# Altium schematic sheet POWER.SchDoc (part 2 of 2)
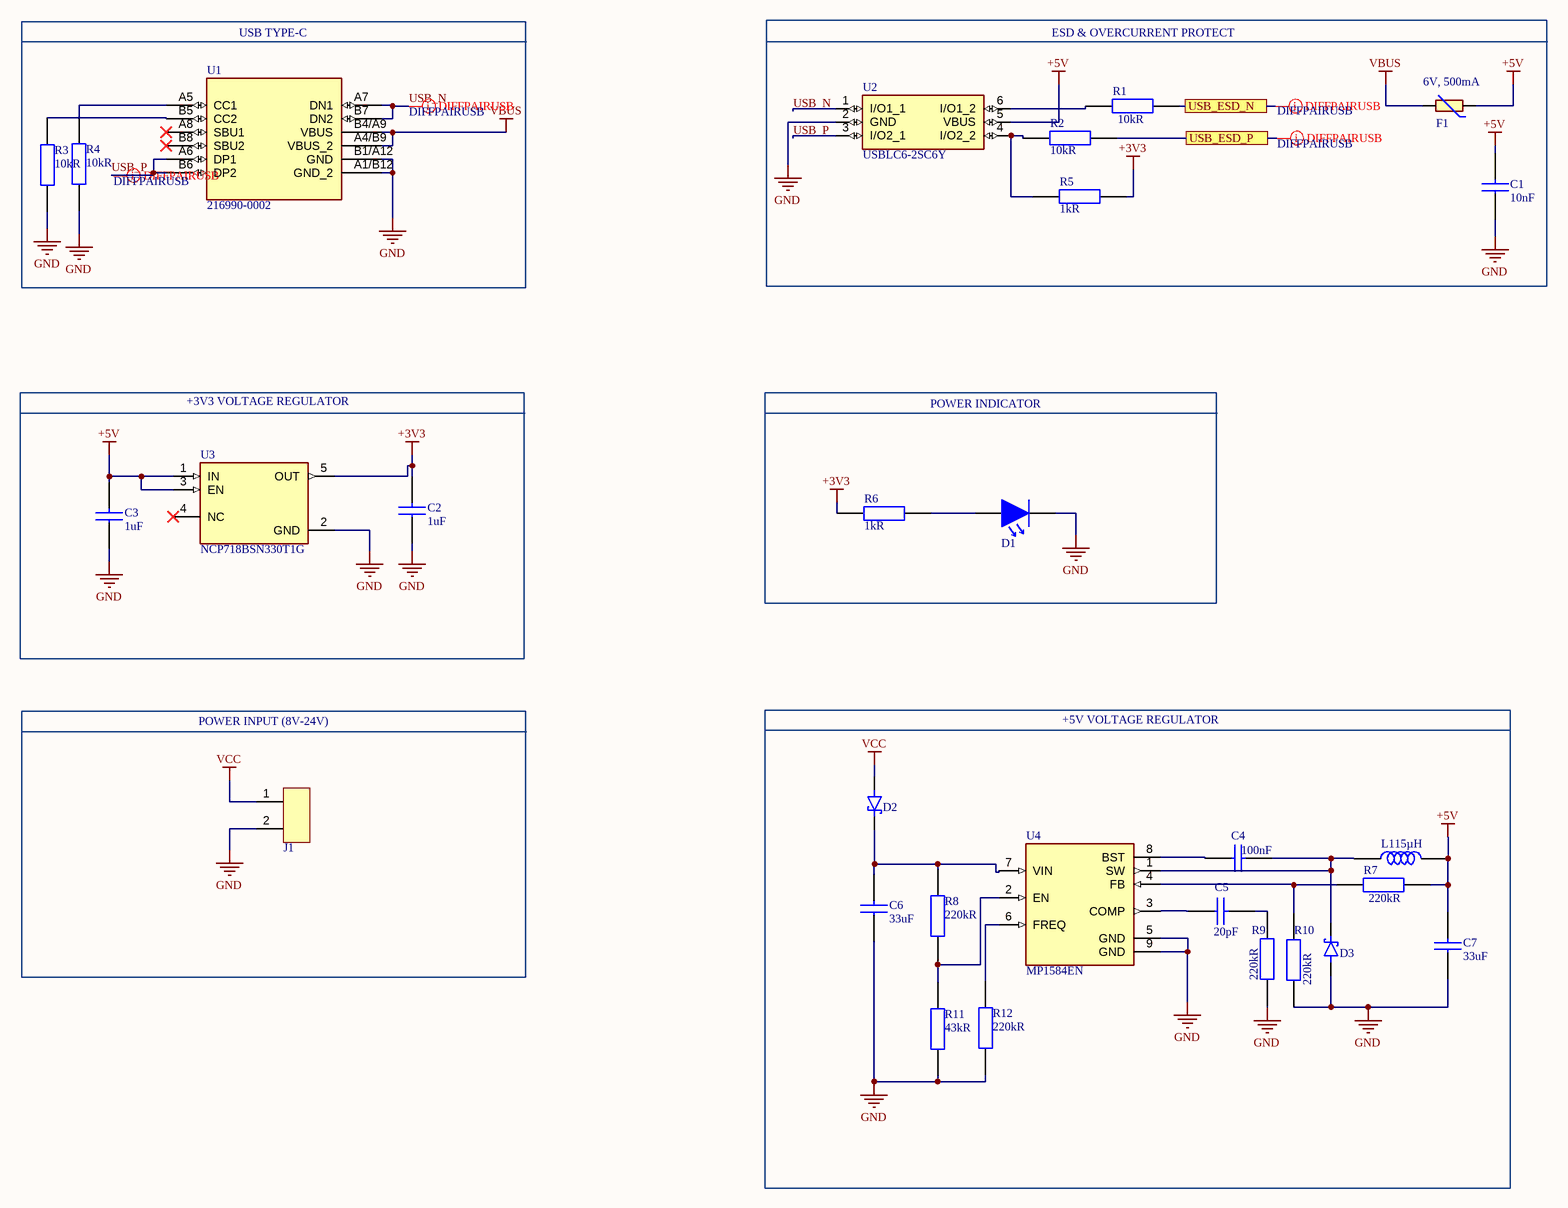
[diagram p1: POWER.SchDoc]

## Library data of the parts
C1 = CAP CER 10nF 0603: CAP CER 10nF %10 0603; Manufacturer: Walsin Technologies; Designed by: BERK; Tolerance: 10%; Dielectric: X7R; Voltage Rating: 16V; Supplier 1: Digi-Key; Manufacturer Part Number: 0603B103K160CT; RoHS: Yes; Category: Ceramic Capacitors; Stock 1: 102474; Pricing 1: 1=0,10000, 10=0,03600, 50=0,01940, 100=0,01590, 500=0,01136, 1000=0,00892 (USD); Case/Package: 0603; Case Code (Metric): 1608; Case Code (Imperial): 0603; Min Operating Temperature: -55°C; Max Operating Temperature: 125°C; Packaging: Tape and Reel; Voltage Rating (DC): 16V; Length: 1.6mm; Depth: 0.8mm; REACH SVHC: Unknown; RoHS Compliant: Yes; ComponentLink1URL: http://www.farnell.com/datasheets/1958513.pdf?src-supplier=Farnell; ComponentLink1Description: http://www.farnell.com/datasheets/1958513.pdf?src-supplier=Farnell; ComponentLink2URL: http://components.arrow.com/part/dataview/0323_00656382?src-supplier=Arrow+Europe; ComponentLink2Description: http://components.arrow.com/part/dataview/0323_00656382?src-supplier=Arrow+Europe; ComponentLink3URL: http://www.farnell.com/datasheets/1958513.pdf?src-supplier=Element14; ComponentLink3Description: http://www.farnell.com/datasheets/1958513.pdf?src-supplier=Element14; ComponentLink4URL: http://www.passivecomponent.com/wp-content/uploads/2018/10/MLCC.pdf?src-supplier=Digi-Key; ComponentLink4Description: http://www.passivecomponent.com/wp-content/uploads/2018/10/MLCC.pdf?src-supplier=Digi-Key; Supplier Part Number 1: 1292-1384-1-ND
C2 C3 = CAP CER 1uF 0805: CAP CER 1uF %10 0805; Manufacturer: Samsung; Designed by: BERK; Tolerance: 10%; Voltage Rating: 50V; Dielectric: X7R; Supplier 1: Digi-Key; Manufacturer Part Number: CL21B105KBFNNNE; RoHS: Yes; Category: Ceramic Capacitors; Stock 1: 958000; Pricing 1: 2000=0,02138, 4000=0,01956 (USD); Mount: Surface Mount; Case/Package: 0805; Case Code (Metric): 2012; Case Code (Imperial): 0805; Min Operating Temperature: -55°C; Max Operating Temperature: 125°C; Packaging: Tape and Reel; Package Quantity: 1; Voltage: 50V; Series: CL; Construction: Flat; Length: 2mm; Width: 0.049inch; Height: 1.25mm; Thickness: 0.053inch; Depth: 1.25mm; Radiation Hardening: No; RoHS Compliant: Yes; ComponentLink1URL: https://datasheet.ciiva.com/25800/cl21b105kbfnnne-25800291.pdf?src-supplier=Digi-Key; ComponentLink1Description: https://datasheet.ciiva.com/25800/cl21b105kbfnnne-25800291.pdf?src-supplier=Digi-Key; ComponentLink2URL: https://datasheet.ciiva.com/16449/cl21b105kbfnnne-16449003.pdf?src-supplier=Future+Electronics; ComponentLink2Description: https://datasheet.ciiva.com/16449/cl21b105kbfnnne-16449003.pdf?src-supplier=Future+Electronics; ComponentLink3URL: https://datasheet.ciiva.com/26838/getdatasheetpartid-354075-26838668.pdf?src-supplier=Verical; ComponentLink3Description: https://datasheet.ciiva.com/26838/getdatasheetpartid-354075-26838668.pdf?src-supplier=Verical; Supplier Part Number 1: 1276-1029-2-ND
C4 = CAP CER 100nF 0603: CAP CER 100nF %10 0603 SMD; Manufacturer: KEMET; Designed by: BERK; Dielectric Material: Ceramic; Voltage Rating (DC): 50V; Tolerance: 10%; Dielectric: X7R; Dissipation Factor: 2.5%; Supplier 1: Digi-Key; Manufacturer Part Number: C0603C104K5RACTU; RoHS: Yes; Category: Ceramic Capacitors; Stock 1: 1666186; Pricing 1: 1=0,12000, 10=0,08500, 50=0,04620, 100=0,03770, 500=0,02696, 1000=0,02118 (USD); Mount: Surface Mount; Case/Package: 0603; Number of Pins: 2; Case Code (Metric): 1608; Case Code (Imperial): 0603; Contact Plating: Tin,Matte; Min Operating Temperature: -55°C; Max Operating Temperature: 125°C; Packaging: Tape and Reel; Package Quantity: 1; Termination: SMD/SMT; Voltage: 50V; Voltage Rating: 50V; Series: SMD Comm X7R; Length: 0.063inch; Width: 0.031inch; Height: 0.8mm; Thickness: 0.034inch; Lead Pitch: 0.7mm; Depth: 0.8mm; Radiation Hardening: No; RoHS Compliant: Yes; REACH SVHC: No SVHC; ComponentLink1URL: https://datasheet.ciiva.com/7823/kem-c1002-x7r-smd-7823591.pdf?src-supplier=Element14; ComponentLink1Description: https://datasheet.ciiva.com/7823/kem-c1002-x7r-smd-7823591.pdf?src-supplier=Element14; ComponentLink2URL: https://datasheet.ciiva.com/14602/70095383-14602583.pdf?src-supplier=Allied+Electronics; ComponentLink2Description: https://datasheet.ciiva.com/14602/70095383-14602583.pdf?src-supplier=Allied+Electronics; ComponentLink3URL: https://datasheet.ciiva.com/5999/kem-c1002-x7r-smd-5999400.pdf?src-supplier=Farnell; ComponentLink3Description: https://datasheet.ciiva.com/5999/kem-c1002-x7r-smd-5999400.pdf?src-supplier=Farnell; ComponentLink4URL: https://datasheet.ciiva.com/7823/kem-c1002-x7r-smd-7823592.pdf?src-supplier=Element14; ComponentLink4Description: https://datasheet.ciiva.com/7823/kem-c1002-x7r-smd-7823592.pdf?src-supplier=Element14; ComponentLink5URL: https://datasheet.ciiva.com/28645/1851736-28645640.pdf?src-supplier=Element14; ComponentLink5Description: https://datasheet.ciiva.com/28645/1851736-28645640.pdf?src-supplier=Element14; ComponentLink6URL: https://datasheet.ciiva.com/14585/70095383-14585209.pdf?src-supplier=Allied+Electronics; ComponentLink6Description: https://datasheet.ciiva.com/14585/70095383-14585209.pdf?src-supplier=Allied+Electronics; Supplier Part Number 1: 399-5089-1-ND
C5 = CAP CER 20pF 0603: CAP CER 20pF %5 0603 SMD; Manufacturer: Samsung; Tolerance: 5%; Dielectric: C0G; Voltage Rating: 50V; Temperature Coefficient: 300ppm/°C; Designed by: BERK; Supplier 1: Digi-Key; Manufacturer Part Number: CL10C200JB8NNNC; RoHS: Yes; Category: Ceramic Capacitors; Stock 1: 765558; Pricing 1: 1=0,10000, 10=0,04700, 50=0,02560, 100=0,02090, 500=0,01490, 1000=0,01171 (USD); Mount: Surface Mount; Case/Package: 0603; Case Code (Metric): 1608; Case Code (Imperial): 0603; Min Operating Temperature: -55°C; Max Operating Temperature: 125°C; Package Quantity: 1; Packaging: Tape and Reel; Voltage: 50V; Series: CL; Construction: Flat; Length: 1.6mm; Width: 0.031inch; Height: 0.8mm; Thickness: 0.035inch; Depth: 0.8mm; Radiation Hardening: No; RoHS Compliant: Yes; ComponentLink1URL: https://datasheet.ciiva.com/26877/getdatasheetpartid-640634-26877974.pdf?src-supplier=Verical; ComponentLink1Description: https://datasheet.ciiva.com/26877/getdatasheetpartid-640634-26877974.pdf?src-supplier=Verical; ComponentLink2URL: https://datasheet.ciiva.com/26310/mlcc-catalogdownload2013-eng-26310315.pdf?src-supplier=Distrelec; ComponentLink2Description: https://datasheet.ciiva.com/26310/mlcc-catalogdownload2013-eng-26310315.pdf?src-supplier=Distrelec; Supplier Part Number 1: 1276-1187-1-ND
C6 C7 = CAP CER 33uF 1206: CAP CER 33uF %20 1206 SMD; Manufacturer: TDK; Dielectric Material: Ceramic; Voltage Rating: 25V; Tolerance: 20%; Dielectric: X5R; Designed by: BERK; Supplier 1: Digi-Key; Manufacturer Part Number: C3216X5R1E336M160AC; RoHS: Yes; Category: Ceramic Capacitors; Stock 1: 149381; Pricing 1: 1=1,04000, 10=0,82500, 50=0,71500, 100=0,61880, 500=0,46750, 1000=0,41250 (USD); Mount: Surface Mount; Case/Package: 1206; Case Code (Metric): 3216; Case Code (Imperial): 1206; Weight: 0.000571oz; Min Operating Temperature: -55°C; Max Operating Temperature: 85°C; Packaging: Tape and Reel; Termination: SMD/SMT; Package Quantity: 1; Voltage Rating (DC): 25V; Resistor Type: Ceramic; Series: C; Length: 3.2mm; Width: 0.063inch; Depth: 1.6mm; Thickness: 1.6mm; REACH SVHC: No SVHC; Lead Free: Lead Free; RoHS Compliant: Yes; ComponentLink1URL: https://datasheet.ciiva.com/24216/c3216x5r1e336m160ac-265051-24216512.pdf?src-supplier=Mouser; ComponentLink1Description: https://datasheet.ciiva.com/24216/c3216x5r1e336m160ac-265051-24216512.pdf?src-supplier=Mouser; ComponentLink2URL: https://datasheet.ciiva.com/6285/tdkmlcccaprange-6285278.pdf?src-supplier=Digi-Key; ComponentLink2Description: https://datasheet.ciiva.com/6285/tdkmlcccaprange-6285278.pdf?src-supplier=Digi-Key; Supplier Part Number 1: 445-8046-1-ND
D1 = LED RED 0805: LED Uni-Color Hyper Red 660nm 2-Pin Chip 0805(2012Metric) T/R; Manufacturer: Osram Opto; Lens Color: White; Forward Voltage: 1.8V; Lens Style: Diffused,Flat,Colorless; Luminous Intensity: 71mcd; Viewing Angle: 160°; Forward Current: 30mA; Dominant Wavelength: 645nm; Number of Elements: 1; Test Current: 20mA; Reverse Voltage: 5V; Lens Transparency: Diffused; Luminous Flux: 0.17lm; Lens Size: 1.25mm; Designed by: BERK; Supplier 1: Digi-Key; Manufacturer Part Number: LH R974-LP-1; RoHS: Yes; Category: LEDs; Stock 1: 35632; Pricing 1: 1=0,26000, 10=0,13900, 100=0,06480, 500=0,05978, 1000=0,04683, 2000=0,04584 (USD); Mount: Surface Mount; Case/Package: 0805; Number of Pins: 2; Color: Red; Case Code (Imperial): 0805; Case Code (Metric): 2012; Min Operating Temperature: -30°C; Max Operating Temperature: 85°C; Packaging: Tape and Reel; Illumination Color: Red; Package Quantity: 1; Series: CHipLED; Length: 2.1mm; Width: 1.25mm; Depth: 1.35mm; Radiation Hardening: No; RoHS Compliant: Yes; ComponentLink1URL: http://www.jameco.com/Jameco/Products/ProdDS/2085634.pdf?src-supplier=Jameco; ComponentLink1Description: http://www.jameco.com/Jameco/Products/ProdDS/2085634.pdf?src-supplier=Jameco; ComponentLink2URL: http://components.arrow.com/part/dataview/0323_01825492?src-supplier=Arrow+Europe; ComponentLink2Description: http://components.arrow.com/part/dataview/0323_01825492?src-supplier=Arrow+Europe; ComponentLink3URL: https://dammedia.osram.info/media/resource/hires/osram-dam-2493888/LH%20R974.pdf?src-supplier=Digi-Key; ComponentLink3Description: https://dammedia.osram.info/media/resource/hires/osram-dam-2493888/LH%20R974.pdf?src-supplier=Digi-Key; ComponentLink4URL: http://www.mouser.com/ds/2/311/LH%20R974%20-%20CHIPLED%200805-318659.pdf?src-supplier=Mouser; ComponentLink4Description: http://www.mouser.com/ds/2/311/LH%20R974%20-%20CHIPLED%200805-318659.pdf?src-supplier=Mouser; ComponentLink5URL: https://www.verical.com/server-webapp/html/getDatasheet?partID=258950&src-supplier=Verical; ComponentLink5Description: https://www.verical.com/server-webapp/html/getDatasheet?partID=258950&src-supplier=Verical; ComponentLink6URL: http://components.arrow.com/part/dataview/41971690S1077610N9133?src-supplier=Arrow+Electronics; ComponentLink6Description: http://components.arrow.com/part/dataview/41971690S1077610N9133?src-supplier=Arrow+Electronics; ComponentLink7URL: http://components.arrow.com/part/dataview/41971690S6190115N2128?src-supplier=Arrow+Electronics; ComponentLink7Description: http://components.arrow.com/part/dataview/41971690S6190115N2128?src-supplier=Arrow+Electronics; Supplier Part Number 1: 475-1415-1-ND
D2 = MBRS320: Schottky Power Rectifier, Surface Mount, Fast Soft-Recovery, 3.0 A, 200 V; Manufacturer: onsemi; Manufacturer Part Number: MBRS3201T3G; Manufacturer Lifecycle Status: ACTIVE; Average Rectified Current: 3A; Element Configuration: Single; Forward Voltage: 590mV; Max Forward Surge Current (Ifsm): 100A; Max Repetitive Reverse Voltage (Vrrm): 200V; Max Reverse Leakage Current: 5µA; Number of Elements: 1; Polarity: Standard; Recovery Time: 35ns; Supplier 1: Future Electronics; RoHS: Compliant; Category: Schottky Diodes; Stock 1: 85000; Pricing 1: 2500=0,255, 5000=0,25 (USD); Case/Package: SMC; China RoHS: Non-Compliant; Contact Plating: Tin; Current Rating: 3A; Forward Current: 3A; Halogen Free: Halogen Free; Height: 2.26mm; Lead Free: Lead Free; Length: 7.11mm; Lifecycle Status: Production; Max Operating Temperature: 150°C; Max Output Current: 3A; Max Reverse Voltage (DC): 200V; Max Surge Current: 100A; Min Operating Temperature: -55°C; Number of Pins: 2; Number of Terminals: 2; Output Current: 3A; Packaging: Tape and Reel; Peak Non-Repetitive Surge Current: 100A; Peak Reverse Current: 5µA; Radiation Hardening: No; REACH SVHC: No; Reverse Recovery Time: 35ns; Reverse Standoff Voltage: 200V; Schedule B: 8541100080; Voltage Rating (DC): 200V; Width: 6.1mm; ComponentLink1URL: https://datasheet.octopart.com:443/MBRS3201T3G-onsemi-datasheet-180961793.pdf?src-supplier=IHS; ComponentLink1Description: https://datasheet.octopart.com:443/MBRS3201T3G-onsemi-datasheet-180961793.pdf?src-supplier=IHS; ComponentLink2URL: https://datasheet.octopart.com:443/MBRS3201T3G-ON-Semiconductor-datasheet-139011814.pdf?src-supplier=Upverter; ComponentLink2Description: https://datasheet.octopart.com:443/MBRS3201T3G-ON-Semiconductor-datasheet-139011814.pdf?src-supplier=Upverter; ComponentLink3URL: https://datasheet.octopart.com:443/MBRS3201T3G-ON-Semiconductor-datasheet-12543837.pdf?src-supplier=element14+APAC; ComponentLink3Description: https://datasheet.octopart.com:443/MBRS3201T3G-ON-Semiconductor-datasheet-12543837.pdf?src-supplier=element14+APAC; ComponentLink4URL: https://datasheet.octopart.com:443/MBRS3201T3G.-ON-Semiconductor-datasheet-93401475.pdf?src-supplier=element14+APAC; ComponentLink4Description: https://datasheet.octopart.com:443/MBRS3201T3G.-ON-Semiconductor-datasheet-93401475.pdf?src-supplier=element14+APAC; ComponentLink5URL: https://datasheet.octopart.com:443/MBRS3201T3G-onsemi-datasheet-181959052.pdf?src-supplier=Farnell; ComponentLink5Description: https://datasheet.octopart.com:443/MBRS3201T3G-onsemi-datasheet-181959052.pdf?src-supplier=Farnell; ComponentLink6URL: https://datasheet.octopart.com:443/MBRS3201T3G-ON-Semiconductor-datasheet-8629983.pdf?src-supplier=Factory+Futures; ComponentLink6Description: https://datasheet.octopart.com:443/MBRS3201T3G-ON-Semiconductor-datasheet-8629983.pdf?src-supplier=Factory+Futures; ComponentLink7URL: https://datasheet.octopart.com:443/MBRS3201T3G-onsemi-datasheet-178031918.pdf?src-supplier=Burklin+Elektronik; ComponentLink7Description: https://datasheet.octopart.com:443/MBRS3201T3G-onsemi-datasheet-178031918.pdf?src-supplier=Burklin+Elektronik; ComponentLink8URL: https://datasheet.octopart.com:443/MBRS3201T3G-ON-Semiconductor-datasheet-14055231.pdf?src-supplier=iiiC; ComponentLink8Description: https://datasheet.octopart.com:443/MBRS3201T3G-ON-Semiconductor-datasheet-14055231.pdf?src-supplier=iiiC; ComponentLink9URL: http://sigma.octopart.com:80/15540786/rohs_certificate/ON-Semiconductor-MBRS3201T3G.pdf?src-supplier=Compliance+Statements; ComponentLink9Description: http://sigma.octopart.com:80/15540786/rohs_certificate/ON-Semiconductor-MBRS3201T3G.pdf?src-supplier=Compliance+Statements; ComponentLink10URL: http://sigma.octopart.com:80/15677732/materials_sheet/ON-Semiconductor-MBRS3201T3G.csv?src-supplier=Compliance+Statements; ComponentLink10Description: http://sigma.octopart.com:80/15677732/materials_sheet/ON-Semiconductor-MBRS3201T3G.csv?src-supplier=Compliance+Statements; ComponentLink11URL: http://sigma.octopart.com:80/150614326/rohs_statement/ON-Semiconductor-MBRS3201T3G.pdf?src-supplier=Compliance+Statements; ComponentLink11Description: http://sigma.octopart.com:80/150614326/rohs_statement/ON-Semiconductor-MBRS3201T3G.pdf?src-supplier=Compliance+Statements; ComponentLink12URL: http://sigma.octopart.com:80/reach_statement/ON-Semiconductor-company-79.pdf?src-supplier=Compliance+Statements; ComponentLink12Description: http://sigma.octopart.com:80/reach_statement/ON-Semiconductor-company-79.pdf?src-supplier=Compliance+Statements; ComponentLink13URL: http://sigma.octopart.com:80/rohs_statement/Fairchild-Semiconductor-company-11.pdf?src-supplier=Compliance+Statements; ComponentLink13Description: http://sigma.octopart.com:80/rohs_statement/Fairchild-Semiconductor-company-11.pdf?src-supplier=Compliance+Statements; ComponentLink14URL: http://sigma.octopart.com:80/rohs_statement/Fairchild-Semiconductor-company-10.pdf?src-supplier=Compliance+Statements; ComponentLink14Description: http://sigma.octopart.com:80/rohs_statement/Fairchild-Semiconductor-company-10.pdf?src-supplier=Compliance+Statements; ComponentLink15URL: http://sigma.octopart.com:80/reach_statement/Fairchild-Semiconductor-company-9.pdf?src-supplier=Compliance+Statements; ComponentLink15Description: http://sigma.octopart.com:80/reach_statement/Fairchild-Semiconductor-company-9.pdf?src-supplier=Compliance+Statements; ComponentLink16URL: https://octopart.com:443/opatz8j6/c1?t=TuUUq4bRV-0zdx1kt4Py_fgXTUouEuO5GdwPZmVDZiTJrU9oCiSD5IIYQQ8xSbjZtkxxPs32EPiDbbV4tmAqIVXMxfHL547gP_Zqw_HyF5TIz1EC-R_T3NYZzPP66QvUkHeWnsvo0ZEGyIDzdOYCi1nx6SNd9l5orHh6SZdF6A3TSZ5L5g70psL6arbhBR678gFMbkKBVgNZP2N4oVk_fZo3cWyfAoJBsl2B_1RNyPR_d_uW0hm-Rf8uT4TfymjIZp_K-d9A2zZ7eX9Eesf9Qcn1GDz3mMBQMfQSqQLDIiBNl7v7-n2E8QOF3VMEy-FVfbOajHd8glM5lbxfLzYmrTDPHLcN0AI8a9bVMQ&src-supplier=Compliance+Statements; ComponentLink16Description: https://octopart.com:443/opatz8j6/c1?t=TuUUq4bRV-0zdx1kt4Py_fgXTUouEuO5GdwPZmVDZiTJrU9oCiSD5IIYQQ8xSbjZtkxxPs32EPiDbbV4tmAqIVXMxfHL547gP_Zqw_HyF5TIz1EC-R_T3NYZzPP66QvUkHeWnsvo0ZEGyIDzdOYCi1nx6SNd9l5orHh6SZdF6A3TSZ5L5g70psL6arbhBR678gFMbkKBVgNZP2N4oVk_fZo3cWyfAoJBsl2B_1RNyPR_d_uW0hm-Rf8uT4TfymjIZp_K-d9A2zZ7eX9Eesf9Qcn1GDz3mMBQMfQSqQLDIiBNl7v7-n2E8QOF3VMEy-FVfbOajHd8glM5lbxfLzYmrTDPHLcN0AI8a9bVMQ&src-supplier=Compliance+Statements; ComponentLink17URL: https://octopart.com:443/opatz8j6/c1?t=ICKq1pvA6Uba8JRY5Wr1hgK7ZgodC260k_nHdvo7TMf1pIWfzOgSMehNdOlqql8BI5NKtuG-eo_HRHcUm0T1O19z6UbrWo1TbzBtqCbO9y4HBHkLi5UCBPB9EG5dhp9_xA_85juhNW86tONOFJ_yMKl7muWCSvblTc487DYcLREb7MfRYwPNJySYVWbsmQ3afWNwoGlIaVOn1GFWckPKWszGThWb5RzZu46iJuG7of7eKMjs05gvHjFqUhN9QV8mb0TviGFOJFeuEotKhRo60y9A6GQh8EX_At8sp5oAjJZUuBif5z1oDU_lCj-aQu0XzT8w-0y7qiLMdom0HYlEjvzid3NufuiGpsAZgKg&src-supplier=Compliance+Statements; ComponentLink17Description: https://octopart.com:443/opatz8j6/c1?t=ICKq1pvA6Uba8JRY5Wr1hgK7ZgodC260k_nHdvo7TMf1pIWfzOgSMehNdOlqql8BI5NKtuG-eo_HRHcUm0T1O19z6UbrWo1TbzBtqCbO9y4HBHkLi5UCBPB9EG5dhp9_xA_85juhNW86tONOFJ_yMKl7muWCSvblTc487DYcLREb7MfRYwPNJySYVWbsmQ3afWNwoGlIaVOn1GFWckPKWszGThWb5RzZu46iJuG7of7eKMjs05gvHjFqUhN9QV8mb0TviGFOJFeuEotKhRo60y9A6GQh8EX_At8sp5oAjJZUuBif5z1oDU_lCj-aQu0XzT8w-0y7qiLMdom0HYlEjvzid3NufuiGpsAZgKg&src-supplier=Compliance+Statements; Supplier Part Number 1: MBRS3201T3G
D3 = B340A-13F: Rectifier Diode, Schottky, 1 Phase, 1 Element, 3A, 40V V(RRM), Silicon, DO-214AC; Manufacturer: Diodes Inc.; Manufacturer Part Number: B340A-13-F; Capacitance: 200pF; Element Configuration: Single; Forward Voltage: 500mV; Max Forward Surge Current (Ifsm): 80A; Max Junction Temperature (Tj): 150°C; Max Power Dissipation: 850mW; Number of Elements: 1; Peak Reverse Current: 500µA; Polarity: Standard; Supplier 1: Future Electronics; RoHS: Compliant; Category: Schottky Diodes; Stock 1: 3535000; Pricing 1: 5000=0,0418, 10000=0,0411, 15000=0,0407, 20000=0,0404, 25000=0,0395 (USD); Average Rectified Current: 3A; Case/Package: SMA; China RoHS: Non-Compliant; Contact Plating: Tin; Country of Origin: Mainland China; Current: 3A; Current Rating: 3A; Export Control Classification Number (ECCN) Code: EAR99; Forward Current: 3A; Height: 2.1mm; Harmonized Tariff Schedule (HTS) Code: 8541.10.00.80; Introduction Date: 2003-02-26; Lead Free: Lead Free; Length: 4.6mm; Lifecycle Status: Production; Max Operating Temperature: 150°C; Max Output Current: 3A; Max Repetitive Reverse Voltage (Vrrm): 40V; Max Reverse Voltage (DC): 40V; Min Operating Temperature: -55°C; Mount: Surface Mount; Number of Pins: 2; Number of Terminals: 2; Output Current: 3A; Packaging: Tape and Reel; Peak Non-Repetitive Surge Current: 80A; Radiation Hardening: No; REACH SVHC: No; Reverse Standoff Voltage: 40V; Reverse Voltage: 40V; Schedule B: 8541100080, 8541100080|8541100080|8541100080|8541100080|8541100080; Termination: SMD/SMT; Voltage: 40V; Voltage Rating (DC): 40V; Weight: 64.013223mg; Width: 2.92mm; ComponentLink1URL: https://sigma.octopart.com:443/138797046/technical_drawing/Diodes-Inc.-B340A-13-F.pdf?src-supplier=Upverter; ComponentLink1Description: https://sigma.octopart.com:443/138797046/technical_drawing/Diodes-Inc.-B340A-13-F.pdf?src-supplier=Upverter; ComponentLink2URL: https://datasheet.octopart.com:443/B340A-13-F-Diodes-Inc.-datasheet-34441423.pdf?src-supplier=Upverter; ComponentLink2Description: https://datasheet.octopart.com:443/B340A-13-F-Diodes-Inc.-datasheet-34441423.pdf?src-supplier=Upverter; ComponentLink3URL: https://datasheet.octopart.com:443/B340A-13-F-Diodes-Inc.-datasheet-78715517.pdf?src-supplier=Newark; ComponentLink3Description: https://datasheet.octopart.com:443/B340A-13-F-Diodes-Inc.-datasheet-78715517.pdf?src-supplier=Newark; ComponentLink4URL: https://datasheet.octopart.com:443/B340A-13-F-Diodes-Inc.-datasheet-62305030.pdf?src-supplier=Newark; ComponentLink4Description: https://datasheet.octopart.com:443/B340A-13-F-Diodes-Inc.-datasheet-62305030.pdf?src-supplier=Newark; ComponentLink5URL: https://datasheet.octopart.com:443/B340A-13-F-Diodes-Inc.-datasheet-8329522.pdf?src-supplier=element14+APAC; ComponentLink5Description: https://datasheet.octopart.com:443/B340A-13-F-Diodes-Inc.-datasheet-8329522.pdf?src-supplier=element14+APAC; ComponentLink6URL: https://datasheet.octopart.com:443/B340A-13-F-Diodes-Inc.-datasheet-10029573.pdf?src-supplier=element14+APAC; ComponentLink6Description: https://datasheet.octopart.com:443/B340A-13-F-Diodes-Inc.-datasheet-10029573.pdf?src-supplier=element14+APAC; ComponentLink7URL: https://datasheet.octopart.com:443/B340A-13-F-Diodes-Inc.-datasheet-5316735.pdf?src-supplier=element14+APAC; ComponentLink7Description: https://datasheet.octopart.com:443/B340A-13-F-Diodes-Inc.-datasheet-5316735.pdf?src-supplier=element14+APAC; ComponentLink8URL: https://datasheet.octopart.com:443/B340A-13-F-Diodes-Inc.-datasheet-14053334.pdf?src-supplier=iiiC; ComponentLink8Description: https://datasheet.octopart.com:443/B340A-13-F-Diodes-Inc.-datasheet-14053334.pdf?src-supplier=iiiC; ComponentLink9URL: https://datasheet.octopart.com:443/B340A-13-F-Diodes-Inc.-datasheet-8326007.pdf?src-supplier=Future+Electronics; ComponentLink9Description: https://datasheet.octopart.com:443/B340A-13-F-Diodes-Inc.-datasheet-8326007.pdf?src-supplier=Future+Electronics; ComponentLink10URL: http://sigma.octopart.com:80/15616884/materials_sheet/Diodes-Inc.-B340A-13-F.pdf?src-supplier=Compliance+Statements; ComponentLink10Description: http://sigma.octopart.com:80/15616884/materials_sheet/Diodes-Inc.-B340A-13-F.pdf?src-supplier=Compliance+Statements; Supplier Part Number 1: B340A-13-F
J1 = TBP01R1-508-02BE: Conn Shrouded Header HDR 2 POS 5.08mm Solder RA Side Entry Thru-Hole Bag; Manufacturer: CUI; Designed by: BERK; Supplier 1: Digi-Key; Manufacturer Part Number: TBP01R1-508-02BE; RoHS: No; Stock 1: 3398; Pricing 1: 1=0,50000, 10=0,26500, 25=0,18760, 50=0,15960, 100=0,15400, 250=0,13020, 500=0,12040, 1000=0,10640, 5000=0,08120 (USD); Supplier Part Number 1: 102-6406-ND
L1 = IND 15uH 3232: Inductor High Current Shielded Wirewound 15uH 20% 100KHz 4.9A 65.3mOhm DCR 3232 T/R; Manufacturer: Vishay; Manufacturer Part Number: IHLP3232DZER150M11; Core Material: Composite; DC Resistance (DCR): 65.3mΩ; Max DC Current: 3.7A; Number of Circuits: 1; Self Resonant Frequency: 10.3MHz; Supplier 1: Farnell; RoHS: Compliant; Category: Fixed Inductors; Stock 1: 705; Pricing 1: 1=1,08, 10=0,926, 50=0,808, 100=0,767, 200=0,728, 500=0,684 (EUR); Case/Package: 3232; China RoHS: Compliant; Composition: Wirewound; Contact Plating: Tin; Current Rating: 4.9A; Depth: 8.26mm; Height: 4mm; Height - Seated (Max): 3.9878mm; Inductance Tolerance: 20%; Lead Free: Lead Free; Length: 8.18mm; Lifecycle Status: Production; Max Current Rating: 4.9A; Max Operating Temperature: 125°C; Military Standard: Not; Min Operating Temperature: -55°C; Mount: Surface Mount; Number of Pins: 2; Number of Terminals: 2; Radiation Hardening: No; REACH SVHC: Yes; Resistance: 65.3mΩ; RMS Current (Irms): 4.9A; Saturation Current: 3.7A; Schedule B: 8504500000, 8504500000|8504500000|8504500000|8504500000|8504500000; Series Resistance: 65.3mΩ; Shielding: Shielded; Termination: SMD/SMT; Test Frequency: 100kHz; Tolerance: 20%; Width: 8.18mm; ComponentLink1URL: https://datasheet.octopart.com:443/IHLP3232DZER150M11-Vishay-datasheet-181468578.pdf?src-supplier=IHS; ComponentLink1Description: https://datasheet.octopart.com:443/IHLP3232DZER150M11-Vishay-datasheet-181468578.pdf?src-supplier=IHS; ComponentLink2URL: https://datasheet.octopart.com:443/IHLP3232DZER150M11-Vishay-datasheet-193387366.pdf?src-supplier=JRH+Electronics; ComponentLink2Description: https://datasheet.octopart.com:443/IHLP3232DZER150M11-Vishay-datasheet-193387366.pdf?src-supplier=JRH+Electronics; ComponentLink3URL: https://datasheet.octopart.com/IHLP3232DZER150M11-Vishay-datasheet-13133375.pdf; ComponentLink3Description: https://datasheet.octopart.com/IHLP3232DZER150M11-Vishay-datasheet-13133375.pdf; ComponentLink4URL: https://datasheet.octopart.com/IHLP3232DZER150M11-Vishay-datasheet-10981368.pdf; ComponentLink4Description: https://datasheet.octopart.com/IHLP3232DZER150M11-Vishay-datasheet-10981368.pdf; ComponentLink5URL: https://datasheet.octopart.com/IHLP3232DZER150M11-Vishay-datasheet-10855091.pdf; ComponentLink5Description: https://datasheet.octopart.com/IHLP3232DZER150M11-Vishay-datasheet-10855091.pdf; ComponentLink6URL: https://datasheet.octopart.com/IHLP3232DZER150M11-Vishay-datasheet-10854409.pdf; ComponentLink6Description: https://datasheet.octopart.com/IHLP3232DZER150M11-Vishay-datasheet-10854409.pdf; ComponentLink7URL: https://datasheet.octopart.com/IHLP3232DZER150M11-Vishay-datasheet-10673122.pdf; ComponentLink7Description: https://datasheet.octopart.com/IHLP3232DZER150M11-Vishay-datasheet-10673122.pdf; ComponentLink8URL: https://datasheet.octopart.com/IHLP3232DZER150M11-Vishay-datasheet-10546874.pdf; ComponentLink8Description: https://datasheet.octopart.com/IHLP3232DZER150M11-Vishay-datasheet-10546874.pdf; ComponentLink9URL: https://datasheet.octopart.com/IHLP3232DZER150M11-Vishay-datasheet-10406895.pdf; ComponentLink9Description: https://datasheet.octopart.com/IHLP3232DZER150M11-Vishay-datasheet-10406895.pdf; ComponentLink10URL: https://datasheet.octopart.com/IHLP3232DZER150M11-Vishay-datasheet-10293436.pdf; ComponentLink10Description: https://datasheet.octopart.com/IHLP3232DZER150M11-Vishay-datasheet-10293436.pdf; ComponentLink11URL: https://datasheet.octopart.com/IHLP3232DZER150M11-Vishay-datasheet-10187444.pdf; ComponentLink11Description: https://datasheet.octopart.com/IHLP3232DZER150M11-Vishay-datasheet-10187444.pdf; ComponentLink12URL: https://datasheet.octopart.com:443/IHLP3232DZER150M11-Vishay-datasheet-67039454.pdf?src-supplier=Farnell; ComponentLink12Description: https://datasheet.octopart.com:443/IHLP3232DZER150M11-Vishay-datasheet-67039454.pdf?src-supplier=Farnell; ComponentLink13URL: https://datasheet.octopart.com:443/IHLP3232DZER150M11-Vishay-datasheet-41195472.pdf?src-supplier=Newark; ComponentLink13Description: https://datasheet.octopart.com:443/IHLP3232DZER150M11-Vishay-datasheet-41195472.pdf?src-supplier=Newark; ComponentLink14URL: https://datasheet.octopart.com:443/IHLP3232DZER150M11-Vishay-datasheet-62320561.pdf?src-supplier=element14+APAC; ComponentLink14Description: https://datasheet.octopart.com:443/IHLP3232DZER150M11-Vishay-datasheet-62320561.pdf?src-supplier=element14+APAC; ComponentLink15URL: https://datasheet.octopart.com:443/IHLP3232DZER150M11-Vishay-Dale-datasheet-41169530.pdf?src-supplier=element14+APAC; ComponentLink15Description: https://datasheet.octopart.com:443/IHLP3232DZER150M11-Vishay-Dale-datasheet-41169530.pdf?src-supplier=element14+APAC; ComponentLink16URL: https://datasheet.octopart.com:443/IHLP3232DZER150M11-Vishay-datasheet-17023530.pdf?src-supplier=Factory+Futures; ComponentLink16Description: https://datasheet.octopart.com:443/IHLP3232DZER150M11-Vishay-datasheet-17023530.pdf?src-supplier=Factory+Futures; ComponentLink17URL: http://sigma.octopart.com:80/rohs_statement/Vishay-company-15.pdf?src-supplier=Compliance+Statements; ComponentLink17Description: http://sigma.octopart.com:80/rohs_statement/Vishay-company-15.pdf?src-supplier=Compliance+Statements; Supplier Part Number 1: IHLP3232DZER150M11; Parameter 1: *
R1-R4 = RES 10K OHM 0603: RES 10K %1 OHM 0603 SMD; Manufacturer: Yageo; Designed by: BERK; Tolerance: 1%; Temperature Coefficient: 100ppm/°C; Voltage Rating (DC): 50V; Power Rating: 100mW; Voltage Rating: 75V; Supplier 1: Digi-Key; Manufacturer Part Number: RC0603FR-0710KL; RoHS: Yes; Category: Chip SMD Resistors; Stock 1: 24140601; Pricing 1: 1=0,10000, 10=0,02300, 100=0,00930, 1000=0,00417, 2500=0,00362 (USD); Case/Package: 0603; Number of Pins: 2; Case Code (Imperial): 0603; Case Code (Metric): 1608; Weight: 7.1E-05oz; Size Code: 0603; Min Operating Temperature: -55°C; Max Operating Temperature: 155°C; Resistor Type: Thick Film; Packaging: Tape and Reel; Termination: SMD/SMT; Features: Moisture Resistant; Series: RC; Max Power Dissipation: 100mW; Number of Terminations: 2; Resistance Tolerance: 1%; Construction: Rectangular; Length: 1.6mm; Width: 0.8mm; Height: 0.45mm; Depth: 0.8mm; Lead Pitch: 0.3mm; REACH SVHC: Unknown; Lead Free: Lead Free; Military Standard: Not; RoHS Compliant: Yes; ComponentLink1URL: https://datasheet.ciiva.com/7660/38590-7660789.pdf?src-supplier=Element14; ComponentLink1Description: https://datasheet.ciiva.com/7660/38590-7660789.pdf?src-supplier=Element14; ComponentLink2URL: https://datasheet.ciiva.com/15189/getdatasheetpartid-409289-15189591.pdf?src-supplier=Verical; ComponentLink2Description: https://datasheet.ciiva.com/15189/getdatasheetpartid-409289-15189591.pdf?src-supplier=Verical; ComponentLink3URL: https://datasheet.ciiva.com/46440/1868787-46440891.pdf?src-supplier=Element14; ComponentLink3Description: https://datasheet.ciiva.com/46440/1868787-46440891.pdf?src-supplier=Element14; ComponentLink4URL: https://datasheet.ciiva.com/7983/443971-7983596.pdf?src-supplier=Element14; ComponentLink4Description: https://datasheet.ciiva.com/7983/443971-7983596.pdf?src-supplier=Element14; ComponentLink5URL: https://datasheet.ciiva.com/7746/1738695-7746239.pdf?src-supplier=Element14; ComponentLink5Description: https://datasheet.ciiva.com/7746/1738695-7746239.pdf?src-supplier=Element14; ComponentLink6URL: https://datasheet.ciiva.com/22747/443971-22747519.pdf?src-supplier=Element14; ComponentLink6Description: https://datasheet.ciiva.com/22747/443971-22747519.pdf?src-supplier=Element14; Supplier Part Number 1: 311-10.0KHRCT-ND
R5 R6 = RES 1K OHM 0603: RES 1K %1 OHM 0603 SMD; Manufacturer: Yageo; Manufacturer Part Number: RC0603JR-071KL; Designed by: BERK; Tolerance: 5%; Temperature Coefficient: 100ppm/°C; Voltage Rating (DC): 50V; Power Rating: 100mW; Body Length: 1.6mm; Supplier 1: Digi-Key; RoHS: Yes; Category: Chip SMD Resistors; Stock 1: 5112056; Pricing 1: 1=0,10000, 10=0,01900, 100=0,00770, 1000=0,00344, 2500=0,00298 (USD); Case/Package: 0603; Number of Pins: 2; Contact Plating: Tin,Matte; Case Code (Imperial): 0603; Case Code (Metric): 1608; Size Code: 0603; Min Operating Temperature: -55°C; Max Operating Temperature: 155°C; Resistor Type: Thick Film; Packaging: Tape and Reel; Package Quantity: 5000; Voltage Rating: 50V; Termination: SMD/SMT; Series: RC; Resistance Tolerance: 5%; Construction: Rectangular; Length: 1.6mm; Width: 0.8mm; Height: 0.45mm; Depth: 0.8mm; Radiation Hardening: No; REACH SVHC: Unknown; Lead Free: Lead Free; Military Standard: Not; RoHS Compliant: Yes; ComponentLink1URL: https://datasheet.ciiva.com/8883/pyu-rc0603-51-rohs-l-4-8883051.pdf?src-supplier=Avnet; ComponentLink1Description: https://datasheet.ciiva.com/8883/pyu-rc0603-51-rohs-l-4-8883051.pdf?src-supplier=Avnet; ComponentLink2URL: https://datasheet.ciiva.com/7746/443971-7746461.pdf?src-supplier=Element14; ComponentLink2Description: https://datasheet.ciiva.com/7746/443971-7746461.pdf?src-supplier=Element14; ComponentLink3URL: https://datasheet.ciiva.com/22747/443971-22747533.pdf?src-supplier=Element14; ComponentLink3Description: https://datasheet.ciiva.com/22747/443971-22747533.pdf?src-supplier=Element14; ComponentLink4URL: https://datasheet.ciiva.com/7746/443971-7746462.pdf?src-supplier=Element14; ComponentLink4Description: https://datasheet.ciiva.com/7746/443971-7746462.pdf?src-supplier=Element14; Supplier Part Number 1: 311-1.0KGRCT-ND
R7-R10 R12 = RES 220K OHM 0603: RES 220K %5 OHM 0603 SMD; Manufacturer: Yageo; Deisgned by: BERK; Tolerance: 5%; Temperature Coefficient: 100ppm/°C; Voltage Rating (DC): 50V; Power Rating: 100mW; Supplier 1: Digi-Key; Manufacturer Part Number: RC0603JR-07220KL; RoHS: Yes; Category: Chip SMD Resistors; Stock 1: 558053; Pricing 1: 1=0,10000, 10=0,01900, 100=0,00770, 1000=0,00344, 2500=0,00298 (USD); Case/Package: 0603; Number of Pins: 2; Case Code (Imperial): 0603; Case Code (Metric): 1608; Size Code: 0603; Min Operating Temperature: -55°C; Max Operating Temperature: 155°C; Resistor Type: Thick Film; Packaging: Tape and Reel; Voltage Rating: 50V; Package Quantity: 1; Termination: SMD/SMT; Number of Terminations: 2; Max Power Dissipation: 100mW; Features: Moisture Resistant; Series: RC; Construction: Rectangular; Resistance Tolerance: 5%; Length: 1.6mm; Width: 0.031inch; Height: 0.022inch; Depth: 0.8mm; REACH SVHC: No SVHC; Lead Free: Lead Free; RoHS Compliant: Yes; Military Standard: Not; ComponentLink1URL: https://datasheet.ciiva.com/2452/pyu-r-int-thick-7-2452923.pdf?src-supplier=Digi-Key; ComponentLink1Description: https://datasheet.ciiva.com/2452/pyu-r-int-thick-7-2452923.pdf?src-supplier=Digi-Key; ComponentLink2URL: https://datasheet.ciiva.com/2452/pyu-r-int-thick-7-2452924.pdf?src-supplier=Digi-Key; ComponentLink2Description: https://datasheet.ciiva.com/2452/pyu-r-int-thick-7-2452924.pdf?src-supplier=Digi-Key; ComponentLink3URL: https://datasheet.ciiva.com/2452/pyu-r-int-thick-7-2452925.pdf?src-supplier=Digi-Key; ComponentLink3Description: https://datasheet.ciiva.com/2452/pyu-r-int-thick-7-2452925.pdf?src-supplier=Digi-Key; Supplier Part Number 1: 311-220KGRCT-ND
R11 = RES 43K OHM 0603: RES 43K %5 OHM 0603 SMD; Manufacturer: Yageo; Designed by: BERK; Voltage Rating: 75V; Power Rating: 100mW; Tolerance: 5%; Temperature Coefficient: 100ppm/°C; Voltage Rating (DC): 50V; Supplier 1: Digi-Key; Manufacturer Part Number: RC0603JR-0743KL; RoHS: Yes; Category: Chip SMD Resistors; Stock 1: 127716; Pricing 1: 1=0,10000, 10=0,01900, 100=0,00770, 1000=0,00344, 2500=0,00298 (USD); Case/Package: 0603; Case Code (Imperial): 0603; Case Code (Metric): 1608; Weight: 7.1E-05oz; Min Operating Temperature: -55°C; Max Operating Temperature: 155°C; Packaging: Tape and Reel; Package Quantity: 1; Termination: SMD/SMT; Resistor Type: Thick Film; Number of Terminations: 2; Max Power Dissipation: 100mW; Working Voltage: 75V; Features: Moisture Resistant; Series: RC; Construction: Rectangular; Technology: THICK FILM; Length: 1.6mm; Width: 0.8mm; Height: 0.022inch; Depth: 0.8mm; Military Standard: Not; Lead Free: Lead Free; RoHS Compliant: Yes; ComponentLink1URL: https://datasheet.ciiva.com/2453/pyu-r-int-thick-7-2453052.pdf?src-supplier=Digi-Key; ComponentLink1Description: https://datasheet.ciiva.com/2453/pyu-r-int-thick-7-2453052.pdf?src-supplier=Digi-Key; ComponentLink2URL: https://datasheet.ciiva.com/2453/pyu-r-int-thick-7-2453053.pdf?src-supplier=Digi-Key; ComponentLink2Description: https://datasheet.ciiva.com/2453/pyu-r-int-thick-7-2453053.pdf?src-supplier=Digi-Key; ComponentLink3URL: https://datasheet.ciiva.com/2453/pyu-r-int-thick-7-2453054.pdf?src-supplier=Digi-Key; ComponentLink3Description: https://datasheet.ciiva.com/2453/pyu-r-int-thick-7-2453054.pdf?src-supplier=Digi-Key; Supplier Part Number 1: 311-43KGRCT-ND
U1 = USB_C 24PIN: USB Connector, 16 Contact(s), Female, Right Angle, Surface Mount Terminal, Locking, Receptacle; Manufacturer: Molex; Contact Resistance: 20mΩ; Current Rating: 1.25A; Insulation Resistance: 100MΩ; Number of Contacts: 16; Number of Ports: 1; USB Standard: USB 2.0; Voltage Rating: 30V; Supplier 1: Farnell; Manufacturer Part Number: 216990-0002; RoHS: Compliant; Category: USB Connectors; Stock 1: 5017; Pricing 1: 1=0,825, 35=0,567, 105=0,519, 280=0,488 (EUR); China RoHS: Compliant; Contact Material: Gold, Nickel; Country of Origin: Mainland China; Export Control Classification Number (ECCN) Code: EAR99; Gender: Female; Harmonized Tariff Schedule (HTS) Code: 8536.69.40.30; Insulation Color: Black; Introduction Date: 2021-08-25; Lifecycle Status: Production; Max Operating Temperature: 85°C; Min Operating Temperature: -40°C; Number of Pins: 16; Number of Positions: 16; Number of Rows: 1; Orientation: Right Angle; REACH SVHC: Yes; Shell Finish: Nickel; Shell Material: Stainless Steel; Terminal Pitch: 500µm; ComponentLink1URL: https://datasheet.octopart.com:443/216990-0002-Molex-datasheet-158830327.pdf?src-supplier=Upverter; ComponentLink1Description: https://datasheet.octopart.com:443/216990-0002-Molex-datasheet-158830327.pdf?src-supplier=Upverter; ComponentLink2URL: https://sigma.octopart.com:443/158830328/technical_drawing/Molex-216990-0002.pdf?src-supplier=Upverter; ComponentLink2Description: https://sigma.octopart.com:443/158830328/technical_drawing/Molex-216990-0002.pdf?src-supplier=Upverter; ComponentLink3URL: https://datasheet.octopart.com:443/216990-0002-Molex-datasheet-193080748.pdf?src-supplier=JRH+Electronics; ComponentLink3Description: https://datasheet.octopart.com:443/216990-0002-Molex-datasheet-193080748.pdf?src-supplier=JRH+Electronics; ComponentLink4URL: https://datasheet.octopart.com:443/216990-0002-Molex-datasheet-164573281.pdf?src-supplier=RS+(Formerly+Allied+Electronics); ComponentLink4Description: https://datasheet.octopart.com:443/216990-0002-Molex-datasheet-164573281.pdf?src-supplier=RS+(Formerly+Allied+Electronics); ComponentLink5URL: http://sigma.octopart.com:80/reach_statement/Molex-company-74.pdf?src-supplier=Compliance+Statements; ComponentLink5Description: http://sigma.octopart.com:80/reach_statement/Molex-company-74.pdf?src-supplier=Compliance+Statements; ComponentLink6URL: http://sigma.octopart.com:80/rohs_statement/Molex-company-73.pdf?src-supplier=Compliance+Statements; ComponentLink6Description: http://sigma.octopart.com:80/rohs_statement/Molex-company-73.pdf?src-supplier=Compliance+Statements; ComponentLink7URL: http://sigma.octopart.com:80/conflict_mineral_statement/Molex-company-72.pdf?src-supplier=Compliance+Statements; ComponentLink7Description: http://sigma.octopart.com:80/conflict_mineral_statement/Molex-company-72.pdf?src-supplier=Compliance+Statements
U2 = USB_LC62: USBLC6 Series 2 Line 6 V Uni / Bi Directional ESD Protection - SOT-23-6; Manufacturer: STMicroelectronics; Breakdown Voltage: 6V; Capacitance: 2.5pF; Clamping Voltage: 17V; Direction: Unidirectional; Element Configuration: Dual; ESD Protection: Yes; Forward Voltage: 860mV; Leakage Current: 150nA; Max Junction Temperature (Tj): 150°C; Number of Bidirectional Channels: 2; Number of Elements: 1; Operating Supply Voltage: 1.1V; Peak Pulse Current: 5A; Reverse Standoff Voltage: 5.25V; Series Resistance: 330Ω; Test Current: 1mA; Supplier 1: Farnell; Manufacturer Part Number: USBLC6-2SC6Y; RoHS: Compliant; Category: TVS Diodes; Stock 1: 231617; Pricing 1: 5=0,55, 50=0,357, 100=0,229, 500=0,159, 1500=0,144 (EUR); Case/Package: SOT-23-6; China RoHS: Compliant; Country of Origin: Malaysia; Depth: 1.75mm; Export Control Classification Number (ECCN) Code: EAR99; Height: 1.45mm; Harmonized Tariff Schedule (HTS) Code: 8541.10.00.50; Introduction Date: 2012-05-16; Lead Free: Lead Free; Length: 3mm; Lifecycle Status: Production; Max Operating Temperature: 150°C; Max Reverse Leakage Current: 150nA; Min Breakdown Voltage: 6V; Min Operating Temperature: -40°C; Mount: Surface Mount; Number of Channels: 2; Number of Pins: 6; Number of Terminals: 6; Packaging: Tape and Reel; Peak Reverse Current: 150nA; Polarity: Unidirectional; Power Line Protection: Yes; Radiation Hardening: No; Ratings: AEC-Q101; REACH SVHC: Yes; Schedule B: 8536300000, 8536300000|8536300000|8536300000|8536300000|8536300000; Termination: SMD/SMT; Width: 1.75mm; ComponentLink1URL: https://datasheet.octopart.com:443/USBLC6-2SC6Y-STMicroelectronics-datasheet-12533815.pdf?src-supplier=ODG+(Origin+Data+Global); ComponentLink1Description: https://datasheet.octopart.com:443/USBLC6-2SC6Y-STMicroelectronics-datasheet-12533815.pdf?src-supplier=ODG+(Origin+Data+Global); ComponentLink2URL: https://datasheet.octopart.com:443/USBLC6-2SC6Y-STMicroelectronics-datasheet-13733956.pdf?src-supplier=STMicroelectronics; ComponentLink2Description: https://datasheet.octopart.com:443/USBLC6-2SC6Y-STMicroelectronics-datasheet-13733956.pdf?src-supplier=STMicroelectronics; ComponentLink3URL: https://datasheet.octopart.com:443/USBLC6-2SC6Y-STMicroelectronics-datasheet-10412581.pdf?src-supplier=Factory+Futures; ComponentLink3Description: https://datasheet.octopart.com:443/USBLC6-2SC6Y-STMicroelectronics-datasheet-10412581.pdf?src-supplier=Factory+Futures; ComponentLink4URL: https://datasheet.octopart.com:443/USBLC6-2SC6Y-STMicroelectronics-datasheet-525477.pdf?src-supplier=Factory+Futures; ComponentLink4Description: https://datasheet.octopart.com:443/USBLC6-2SC6Y-STMicroelectronics-datasheet-525477.pdf?src-supplier=Factory+Futures
U3 = NCP718B: LDO Regulator, 300 mA, Wide Vin, Ultra-Low Iq Fixed 3.3V, Non-Active Discharge, TSOT23-5; Manufacturer: onsemi; Manufacturer Lifecycle Status: ACTIVE; Accuracy: 2%; Dropout Voltage: 275mV; Max Input Voltage: 24V; Max Junction Temperature (Tj): 125°C; Min Input Voltage: 4.3V; Number of Channels: 1; Output Current: 300mA; Supplier 1: Farnell; Manufacturer Part Number: NCP718BSN330T1G; RoHS: Compliant; Category: LDO Voltage Regulators; Stock 1: 12771; Pricing 1: 3000=0,197 (EUR); Case/Package: VSSOP; China RoHS: Compliant; Country of Origin: Thailand; Export Control Classification Number (ECCN) Code: EAR99; Height: 1mm; Height - Seated (Max): 1mm; Harmonized Tariff Schedule (HTS) Code: 8542.39.00.60; Introduction Date: 2018-03-21; Length: 2.9mm; Lifecycle Status: Production; Max Operating Temperature: 150°C; Max Supply Voltage: 24V; Min Supply Voltage: 4.3V; Number of Circuits: 1; Number of Outputs: 1; Number of Terminals: 5; Output Type: Fixed; Output Voltage: 3.3V; Ratings: AEC-Q100; REACH SVHC: Yes; Schedule B: 8542390000, 8542390000|8542390000|8542390000|8542390000|8542390000; Terminal Pitch: 950µm; Voltage Tolerance: 2%; Width: 1.6mm; ComponentLink1URL: https://datasheet.octopart.com:443/NCP718BSN330T1G-onsemi-datasheet-180965627.pdf?src-supplier=IHS; ComponentLink1Description: https://datasheet.octopart.com:443/NCP718BSN330T1G-onsemi-datasheet-180965627.pdf?src-supplier=IHS; ComponentLink2URL: https://datasheet.octopart.com:443/NCP718BSN330T1G-onsemi-datasheet-156001541.pdf?src-supplier=Upverter; ComponentLink2Description: https://datasheet.octopart.com:443/NCP718BSN330T1G-onsemi-datasheet-156001541.pdf?src-supplier=Upverter; ComponentLink3URL: https://sigma.octopart.com:443/138897405/technical_drawing/onsemi-NCP718BSN330T1G.pdf?src-supplier=Upverter; ComponentLink3Description: https://sigma.octopart.com:443/138897405/technical_drawing/onsemi-NCP718BSN330T1G.pdf?src-supplier=Upverter; ComponentLink4URL: https://datasheet.octopart.com:443/NCP718BSN330T1G-ON-Semiconductor-datasheet-118180658.pdf?src-supplier=JRH+Electronics; ComponentLink4Description: https://datasheet.octopart.com:443/NCP718BSN330T1G-ON-Semiconductor-datasheet-118180658.pdf?src-supplier=JRH+Electronics; ComponentLink5URL: https://datasheet.octopart.com:443/NCP718BSN330T1G-ON-Semiconductor-datasheet-95952869.pdf?src-supplier=onsemi; ComponentLink5Description: https://datasheet.octopart.com:443/NCP718BSN330T1G-ON-Semiconductor-datasheet-95952869.pdf?src-supplier=onsemi; ComponentLink6URL: https://datasheet.octopart.com:443/NCP718BSN330T1G-onsemi-datasheet-164417801.pdf?src-supplier=Augswan; ComponentLink6Description: https://datasheet.octopart.com:443/NCP718BSN330T1G-onsemi-datasheet-164417801.pdf?src-supplier=Augswan; ComponentLink7URL: http://sigma.octopart.com:80/150624081/rohs_statement/ON-Semiconductor-NCP718BSN330T1G.pdf?src-supplier=Compliance+Statements; ComponentLink7Description: http://sigma.octopart.com:80/150624081/rohs_statement/ON-Semiconductor-NCP718BSN330T1G.pdf?src-supplier=Compliance+Statements; ComponentLink8URL: http://sigma.octopart.com:80/reach_statement/ON-Semiconductor-company-79.pdf?src-supplier=Compliance+Statements; ComponentLink8Description: http://sigma.octopart.com:80/reach_statement/ON-Semiconductor-company-79.pdf?src-supplier=Compliance+Statements; ComponentLink9URL: https://octopart.com:443/opatz8j6/c1?t=z0SjjS1aZyVj4hpX5vVj4wbC0E02yp2xM3JkvAzJKOInFKFpeuivvTlCOb44YSB_HKOUzbSm5ZS-EO9i1oqjg_lFqOk22wfTUy00ns7o_dknGn8FeV5USBBxFGRw-HQA70h7sfihBJ0obPcno1c5MP7AQFcY6h-XVFqwkwKB8w-wluEaVgjruRbUGw6_10_64SdzVoZaT4mdtG7Ewmjt3QQ5f64pf7sY3DgnQ06z3evh7Zx0yROl8ZIBx1im_ijXmyvVwDVc7g9HRrpWRP_ZIurhPRr0SB5rLwmMN7I3dtpSCFuDCKdBEa2Sh4HE3nCoFJYsDyuHnkzlbF09PJh8r8Grw61lDJrTfryr1p7hhJJgYQ&src-supplier=Compliance+Statements; ComponentLink9Description: https://octopart.com:443/opatz8j6/c1?t=z0SjjS1aZyVj4hpX5vVj4wbC0E02yp2xM3JkvAzJKOInFKFpeuivvTlCOb44YSB_HKOUzbSm5ZS-EO9i1oqjg_lFqOk22wfTUy00ns7o_dknGn8FeV5USBBxFGRw-HQA70h7sfihBJ0obPcno1c5MP7AQFcY6h-XVFqwkwKB8w-wluEaVgjruRbUGw6_10_64SdzVoZaT4mdtG7Ewmjt3QQ5f64pf7sY3DgnQ06z3evh7Zx0yROl8ZIBx1im_ijXmyvVwDVc7g9HRrpWRP_ZIurhPRr0SB5rLwmMN7I3dtpSCFuDCKdBEa2Sh4HE3nCoFJYsDyuHnkzlbF09PJh8r8Grw61lDJrTfryr1p7hhJJgYQ&src-supplier=Compliance+Statements; ComponentLink10URL: https://octopart.com:443/opatz8j6/c1?t=n9LQeOBviOVt4kI1beH1kC99kMfogPmC3oJBY2_7J-qhsq_Sp3Wd4K0G5iKivtvP0hTRjiwjpdacUo52MmvmaiUjm2lC83lbfXHZ4vyOU8RAwSlZ1tO2nlHrBdZSlhn4XIN10GanEOx3WYyPD-AUpl9U84o6ZMlprjsJE3UgGegXGKGosoFjibu6V0XOw7HShO_QH5HjzxUHL8dp3lwnNNSwTlKUenOoGNv54LAI_k1R-11UrqOBV4m18JP99C5DzNJGF65TSwqjJu1kfHp2QOnMAdqtHXFEOUlK05g5lqN8wOQflCAR6PT57CAt8c5PneSQN_gPksI66eRt8GquPz-s16dthuO-sfir3BDjmCfQ7hY&src-supplier=Compliance+Statements; ComponentLink10Description: https://octopart.com:443/opatz8j6/c1?t=n9LQeOBviOVt4kI1beH1kC99kMfogPmC3oJBY2_7J-qhsq_Sp3Wd4K0G5iKivtvP0hTRjiwjpdacUo52MmvmaiUjm2lC83lbfXHZ4vyOU8RAwSlZ1tO2nlHrBdZSlhn4XIN10GanEOx3WYyPD-AUpl9U84o6ZMlprjsJE3UgGegXGKGosoFjibu6V0XOw7HShO_QH5HjzxUHL8dp3lwnNNSwTlKUenOoGNv54LAI_k1R-11UrqOBV4m18JP99C5DzNJGF65TSwqjJu1kfHp2QOnMAdqtHXFEOUlK05g5lqN8wOQflCAR6PT57CAt8c5PneSQN_gPksI66eRt8GquPz-s16dthuO-sfir3BDjmCfQ7hY&src-supplier=Compliance+Statements
U4 = MP1584EN: MP1584 Series 28 V 3 A 1.5 MHz SMT Step-Down Converter - SOIC-8E; Manufacturer: Monolithic Power Systems; Manufacturer Part Number: MP1584EN-LF-Z; Manufacturer Lifecycle Status: NRFND; Max Input Voltage: 28V; Max Junction Temperature (Tj): 125°C; Max Output Current: 3A; Max Output Voltage: 25V; Max Power Dissipation: 2.5W; Max Switching Frequency: 1.5MHz; Min Input Voltage: 4.5V; Min Output Voltage: 800mV; Nominal Input Voltage: 12V; Nominal Output Voltage: 3.3V; Nominal Supply Current: 100µA; Number of Channels: 1; Output Configuration: Positive; Output Type: Adjustable; Synchronous Rectifier: No; Topology: Buck; Supplier 1: Future Electronics; RoHS: Compliant; Category: Voltage Regulators - Switching; Pricing 1: 2500=1,27 (USD); Ambient Temperature Range High: 85°C; Case/Package: SOIC; Contact Plating: Tin; Height: 1.7mm; Height - Seated (Max): 1.7mm; Lead Free: Lead Free; Length: 4.9mm; Lifecycle Status: NRND; Max Operating Temperature: 85°C; Max Supply Voltage: 28V; Min Operating Temperature: -20°C; Min Supply Voltage: 4.5V; Mount: Surface Mount; Number of Circuits: 1; Number of Outputs: 1; Number of Pins: 8; Number of Terminals: 8; Operating Supply Voltage: 28V; Output Current: 3A; Output Voltage: 25V; REACH SVHC: Yes; Switching Frequency: 1.5MHz; Terminal Pitch: 1.27mm; Width: 3.9mm; ComponentLink1URL: https://datasheet.octopart.com:443/MP1584EN-LF-Z-Monolithic-Power-Systems-datasheet-155981995.pdf?src-supplier=Monolithic+Power+Systems; ComponentLink1Description: https://datasheet.octopart.com:443/MP1584EN-LF-Z-Monolithic-Power-Systems-datasheet-155981995.pdf?src-supplier=Monolithic+Power+Systems; ComponentLink2URL: https://datasheet.octopart.com:443/MP1584EN-LF-Z-Monolithic-Power-Systems-datasheet-180786201.pdf?src-supplier=IHS; ComponentLink2Description: https://datasheet.octopart.com:443/MP1584EN-LF-Z-Monolithic-Power-Systems-datasheet-180786201.pdf?src-supplier=IHS; ComponentLink3URL: https://datasheet.octopart.com:443/MP1584EN-LF-Z-Monolithic-Power-Systems-datasheet-138896877.pdf?src-supplier=Upverter; ComponentLink3Description: https://datasheet.octopart.com:443/MP1584EN-LF-Z-Monolithic-Power-Systems-datasheet-138896877.pdf?src-supplier=Upverter; ComponentLink4URL: https://datasheet.octopart.com:443/MP1584EN-LF-Z-Monolithic-Power-Systems-datasheet-28355791.pdf?src-supplier=Augswan; ComponentLink4Description: https://datasheet.octopart.com:443/MP1584EN-LF-Z-Monolithic-Power-Systems-datasheet-28355791.pdf?src-supplier=Augswan; ComponentLink5URL: https://datasheet.octopart.com:443/MP1584EN-LF-Z-Monolithic-Power-Systems-datasheet-157246321.pdf?src-supplier=LKR; ComponentLink5Description: https://datasheet.octopart.com:443/MP1584EN-LF-Z-Monolithic-Power-Systems-datasheet-157246321.pdf?src-supplier=LKR; ComponentLink6URL: https://datasheet.octopart.com:443/MP1584EN-LF-Z-Monolithic-Power-Systems-datasheet-130112029.pdf?src-supplier=TME; ComponentLink6Description: https://datasheet.octopart.com:443/MP1584EN-LF-Z-Monolithic-Power-Systems-datasheet-130112029.pdf?src-supplier=TME; ComponentLink7URL: https://datasheet.octopart.com:443/MP1584EN-LF-Z-Monolithic-Power-Systems-datasheet-26504489.pdf?src-supplier=Future+Electronics; ComponentLink7Description: https://datasheet.octopart.com:443/MP1584EN-LF-Z-Monolithic-Power-Systems-datasheet-26504489.pdf?src-supplier=Future+Electronics; Supplier Info: MP1584EN